# EAGLE design nrfsensornode (EAGLE 6.5.0)
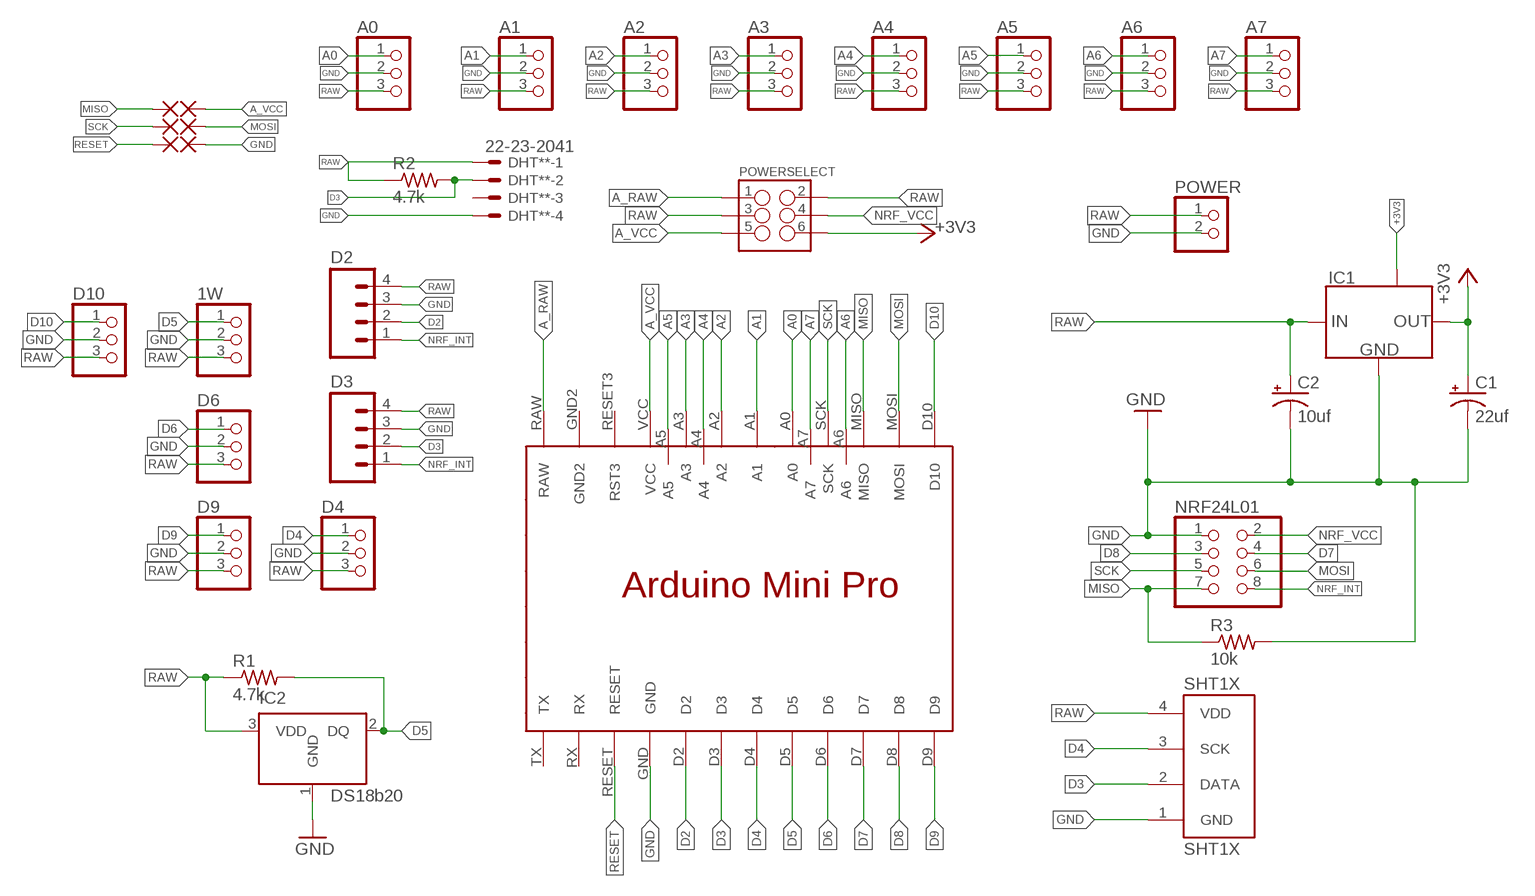
[diagram p0: schematic, sheet 1]

## Parts
1W  PINHD-1X3  [1X03]
5V  WIREPADSMD1,27-254  [SMD1,27-2,54]
A0  PINHD-1X3  [1X03]
A1  PINHD-1X3  [1X03]
A2  PINHD-1X3  [1X03]
A3  PINHD-1X3  [1X03]
A4  PINHD-1X3  [1X03]
A5  PINHD-1X3  [1X03]
A6  PINHD-1X3  [1X03]
A7  PINHD-1X3  [1X03]
C1  22uf  CPOL-USE2-4  [E2-4]
C2  10uf  CPOL-USE2-4  [E2-4]
D2  M04LOCK  [1X04_LOCK]
D3  M04LOCK  [1X04_LOCK]
D4  PINHD-1X3  [1X03]
D6  PINHD-1X3  [1X03]
D9  PINHD-1X3  [1X03]
D10  PINHD-1X3  [1X03]
DHT**  22-23-2041  [22-23-2041]
GND  WIREPADSMD1,27-254  [SMD1,27-2,54]
IC1  LM1117MPX-3.3  [SOT-223]
IC2  DS18b20  DS1820  [TO-92]
MISO  WIREPADSMD1,27-254  [SMD1,27-2,54]
MOSI  WIREPADSMD1,27-254  [SMD1,27-2,54]
NRF24L01  PINHD-2X4  [2X04]
POWER  PINHD-1X2  [1X02]
POWERSELECT  M03X2POGO_PINS  [2X3_POGO]
R1  4.7k  R-US_M1206  [M1206]
R2  4.7k  R-US_M1206  [M1206]
R3  10k  R-US_M1206  [M1206]
RST  WIREPADSMD1,27-254  [SMD1,27-2,54]
SCK  WIREPADSMD1,27-254  [SMD1,27-2,54]
SHT1X  SHT1X  [SHT1X]
U$1  ARDMINIPRO  [ARDMINIPRO]

## Nets
+3V3: C1.+ IC1.2(OUT) IC1.4(NC) POWERSELECT.P$6
A0: A0.1 U$1.A0
A1: A1.1 U$1.A1
A2: A2.1 U$1.A2
A3: A3.1 U$1.A3
A4: A4.1 U$1.A4
A5: A5.1 U$1.A5
A6: A6.1 U$1.A6
A7: A7.1 U$1.A7
A_RAW: POWERSELECT.P$1 U$1.RAW
A_VCC: 5V.1(P) POWERSELECT.P$5 U$1.VCC
D2: D2.2 U$1.D2
D3: D3.2 DHT**.2 R2.2 SHT1X.2(DATA) U$1.D3
D4: D4.1 SHT1X.3(SCK) U$1.D4
D5: 1W.1 IC2.2(DQ) R1.2 U$1.D5
D6: D6.1 U$1.D6
D7: NRF24L01.4 U$1.D7
D8: NRF24L01.3 U$1.D8
D9: D9.1 U$1.D9
D10: D10.1 U$1.D10
GND: 1W.2 A0.2 A1.2 A2.2 A3.2 A4.2 A5.2 A6.2 A7.2 C1.- C2.- D2.3 D3.3 D4.2 D6.2 D9.2 D10.2 DHT**.4 GND.1(P) IC1.1(GND) IC2.1(GND) NRF24L01.1 POWER.2 R3.2 SHT1X.1(GND) U$1.GND
MISO: MISO.1(P) NRF24L01.7 R3.1 U$1.MISO
MOSI: MOSI.1(P) NRF24L01.6 U$1.MOSI
NRF_INT: D2.1 D3.1 NRF24L01.8
NRF_VCC: NRF24L01.2 POWERSELECT.P$4
RAW: 1W.3 A0.3 A1.3 A2.3 A3.3 A4.3 A5.3 A6.3 A7.3 C2.+ D2.4 D3.4 D4.3 D6.3 D9.3 D10.3 DHT**.1 IC1.3(IN) IC2.3(VDD) POWER.1 POWERSELECT.P$2 POWERSELECT.P$3 R1.1 R2.1 SHT1X.4(VDD)
RESET: RST.1(P) U$1.RESET
SCK: NRF24L01.5 SCK.1(P) U$1.SCK
Unconnected: DHT**.3 U$1.GND2 U$1.RESET3(RST3) U$1.RX U$1.TX

## Library data of the parts
1W A0 A1-A7 D4 D6 D9 D10 = adafruit:PINHD-1X3: PIN HEADER
5V GND MISO MOSI RST SCK = wirepad:WIREPAD: Wire PAD connect wire on PCB
C1 C2 = adafruit:CPOL-US: POLARIZED CAPACITOR, American symbol
D2 D3 = SparkFun-Connectors:M04: Header 4 Standard 4-pin 0.1" header. Use with straight break away headers (SKU : PRT-00116), right angle break away headers (PRT-00553), swiss pins (PRT-00743), machine pins (PRT-00117), and female headers (PRT-00115). Molex polarized connector foot print use with SKU : PRT-08231 with associated crimp pins and housings. 1MM SMD Version SKU: PRT-10208
DHT** = con-molex:22-23-2041: .100" (2.54mm) Center Header - 4 Pin; MF: MOLEX; MPN: 22-23-2041; OC_FARNELL: 1462920; OC_NEWARK: 38C0355
IC1 = v-reg-lm1117:LM1117?*
IC2 = DS1820:DS1820: DS1820 - 1-Wire Digital Thermometer
NRF24L01 = pinhead:PINHD-2X4: PIN HEADER
POWER = pinhead:PINHD-1X2: PIN HEADER
POWERSELECT = SparkFun-Connectors:M03X2: 2x3 .1" header. Shrouded, with keying- CONN-10681 SMT- CONN-11415 Pogo pins- HW-11044; PROD_ID: HW-11044
R1-R3 = adafruit:R-US_: RESISTOR, American symbol
SHT1X = sht10_11_15:SHT1X
U$1 = zarya:ARDMINIPRO

## Board
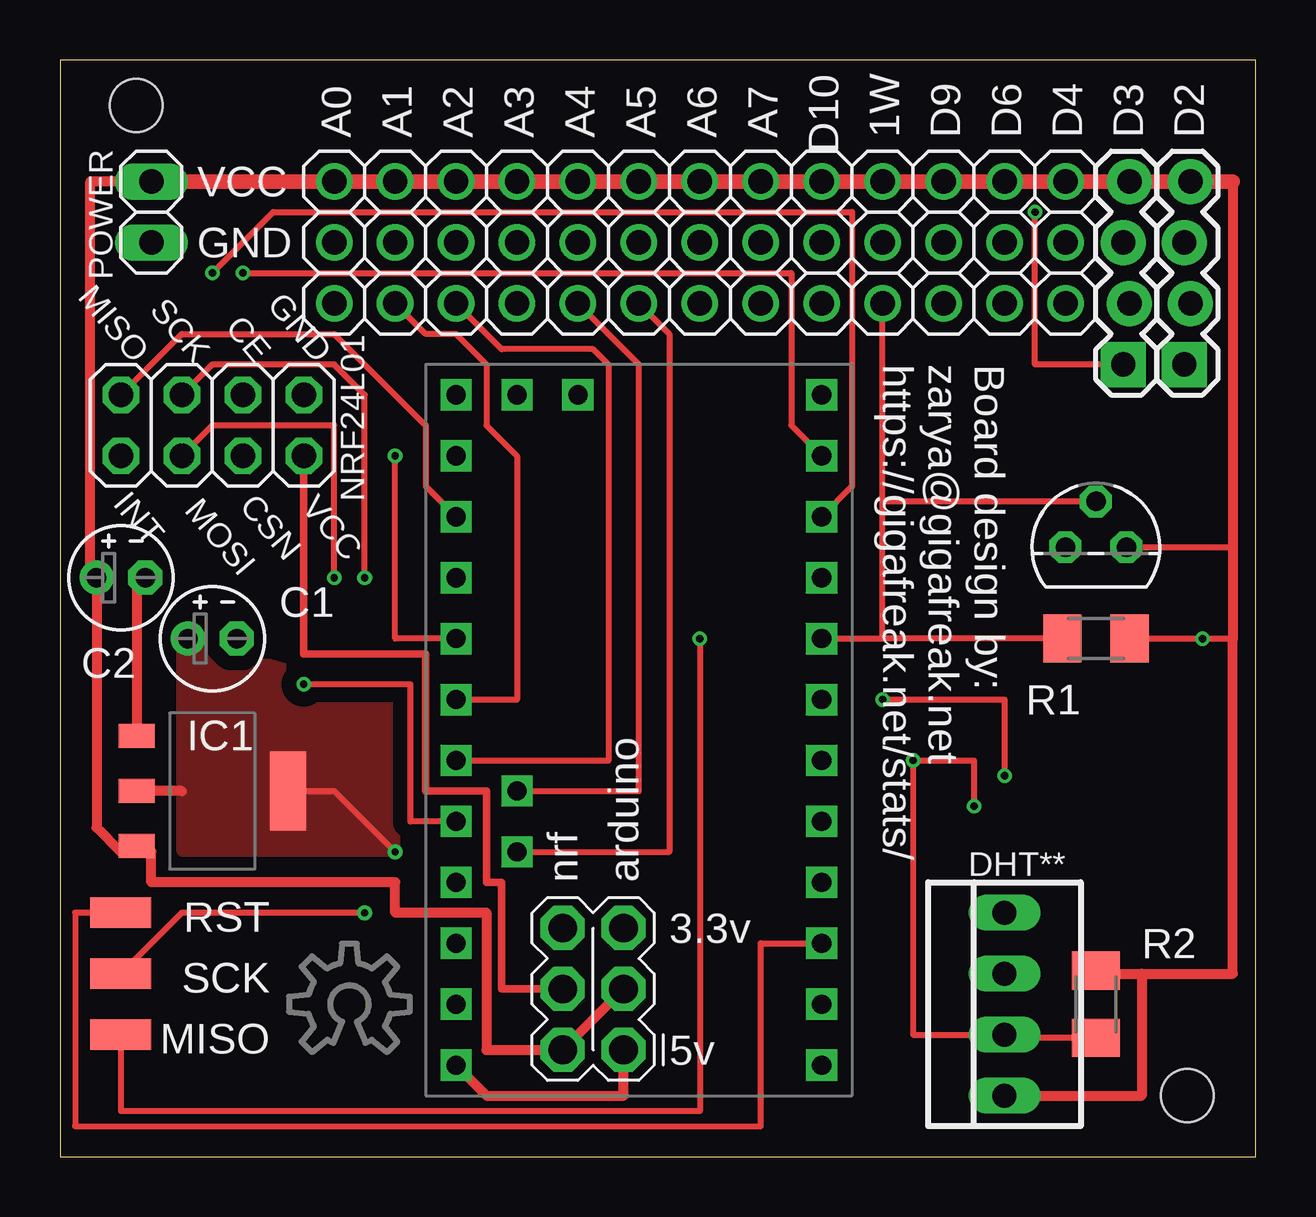
[diagram p1: board, top side]
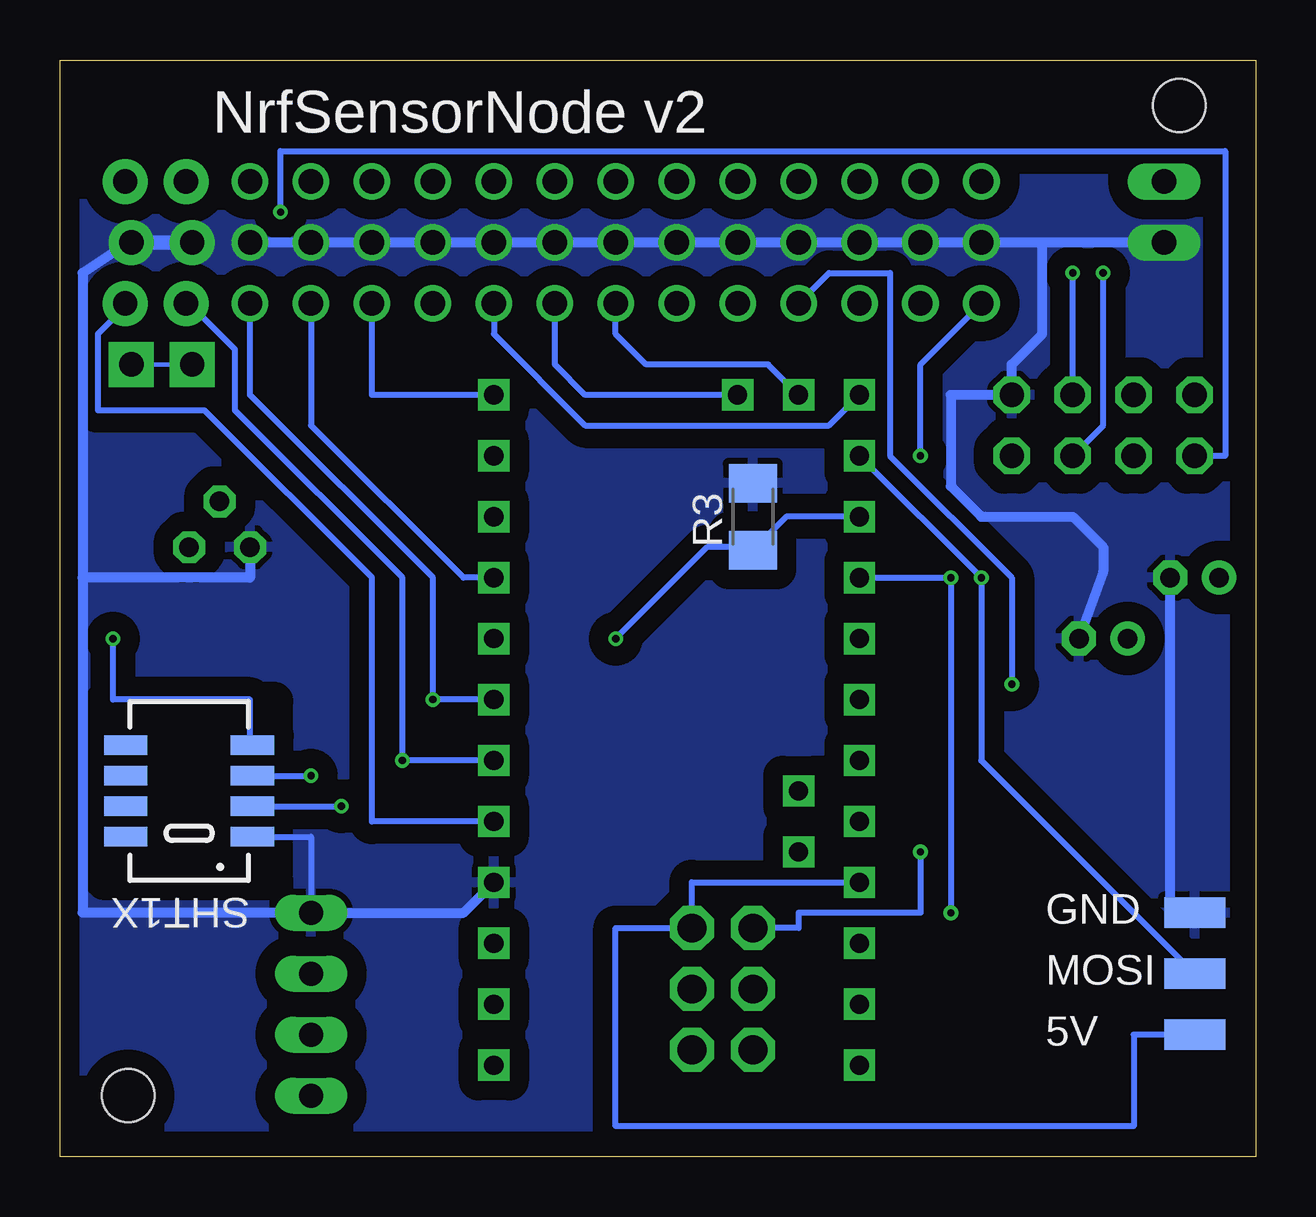
[diagram p2: board, bottom side, seen from below]

Size 49.84 x 45.71 mm. Coordinates in mm from the lower left corner, seen from the top.
Outline: 0,0 49.84,0 49.84,45.71 0,45.71 0,0
Copper layers (1*16): Top 0.035mm / dielectric 1.5mm / Bottom 0.035mm
Design rules "Smart-Prototyping": minimum track width 7mil, minimum drill 12mil, track to track 7mil, track to pad 7mil, pad to pad 7mil, via to via 7mil, smd to smd 0mil, copper to edge 20mil, drill to drill 10mil, minimum pad ring 10mil, minimum via ring 6mil, stop-mask expansion 2mil, vias tented up to drill 25mil, thermal gap 10mil
Holes 2.2 mm at 3.17,43.81 46.99,2.54

### Footprints (pad centres in the part's own frame; a part is rotated, then mirrored left to right if it is on the bottom)
1X03 = drill 1.016: 1 -2.54,0; 2 0,0; 3 2.54,0
SMD1,27-2,54 = smd 1.27 x 2.54: 1 0,0
E2-4 = drill 0.813 pad 1.422: + -1.016,0 | drill 0.813 pad 1.422 octagon: - 1.016,0
1X04_LOCK = drill 1.016 pad 1.88 square: 1 0,0.127 | drill 1.016 pad 1.88: 2 2.54,-0.127; 3 5.08,0.127; 4 7.62,-0.127
22-23-2041 = drill 1 long: 1 -3.81,0; 2 -1.27,0; 3 1.27,0; 4 3.81,0
SOT-223 = smd 1 x 1.5: 1 -2.3,-3.15; 2 0,-3.15; 3 2.3,-3.15 | smd 3.3 x 1.5: 4 0,3.15
TO-92 = drill 0.813 pad 1.27 octagon: 1 -1.27,0; 2 0,1.905; 3 1.27,0
2X04 = drill 1.016 octagon: 1 -3.81,-1.27; 2 -3.81,1.27; 3 -1.27,-1.27; 4 -1.27,1.27; 5 1.27,-1.27; 6 1.27,1.27; 7 3.81,-1.27; 8 3.81,1.27
1X02 = drill 1.016 long: 1 -1.27,0; 2 1.27,0
2X3_POGO = drill 1.2 pad 1.829 octagon: P$1 0,0; P$2 0,2.54; P$3 2.54,0; P$4 2.54,2.54; P$5 5.08,0; P$6 5.08,2.54
M1206 = smd 1.6 x 2: 1 -1.4,0; 2 1.4,0
SHT1X = smd 1.803 x 0.8: 1 -2.642,1.905; 2 -2.642,0.635; 3 -2.642,-0.635; 4 -2.642,-1.905; 5 2.642,-1.905; 6 2.642,-0.635; 7 2.642,0.635; 8 2.642,1.905
ARDMINIPRO = drill 0.8 square: A0 7.62,-3.81; A1 7.62,-1.27; A2 7.62,1.27; A3 7.62,3.81; A4 5.08,2.54; A5 5.08,5.08; A6 5.08,-13.97; A7 2.54,-13.97; D2 -7.62,3.81; D3 -7.62,1.27; D4 -7.62,-1.27; D5 -7.62,-3.81; D6 -7.62,-6.35; D7 -7.62,-8.89; D8 -7.62,-11.43; D9 -7.62,-13.97; D10 7.62,-13.97; GND -7.62,6.35; GND2 7.62,11.43; MISO 7.62,-8.89; MOSI 7.62,-11.43; RAW 7.62,13.97; RESET -7.62,8.89; RESET3 7.62,8.89; RX -7.62,11.43; SCK 7.62,-6.35; TX -7.62,13.97; VCC 7.62,6.35

### Placement (x,y rotation side)
1W  34.29,38.1 90 top
5V  2.54,5.08 270 bottom
A0  11.43,38.1 90 top
A1  13.97,38.1 90 top
A2  16.51,38.1 90 top
A3  19.05,38.1 90 top
A4  21.59,38.1 90 top
A5  24.13,38.1 90 top
A6  26.67,38.1 90 top
A7  29.21,38.1 90 top
C1  6.35,21.59 0 top
C2  2.54,24.13 0 top
D2  46.99,33.02 90 top
D3  44.45,33.02 90 top
D4  41.91,38.1 90 top
D6  39.37,38.1 90 top
D9  36.83,38.1 90 top
D10  31.75,38.1 90 top
DHT**  39.37,6.35 90 top
GND  2.54,10.16 270 bottom
IC1  6.35,15.24 270 top
IC2  43.18,25.4 0 top
MISO  2.54,5.08 90 top
MOSI  2.54,7.62 270 bottom
NRF24L01  6.35,30.48 180 top
POWER  3.81,39.37 270 top
POWERSELECT  23.5,4.45 90 top
R1  43.18,21.59 180 top
R2  43.18,6.35 270 top
R3  20.95,26.67 90 bottom
RST  2.54,10.16 90 top
SCK  2.54,7.62 90 top
SHT1X  44.45,15.24 180 bottom
U$1  24.13,17.78 180 top
U$2  [OSHWLOGO_TOL_0.2]  12.06,6.35 0 top

### Tracks (layer width: path | path; a pad name or v marks a point on that pad's centre or on a via)
+3V3  (via drill 0.3)
  Top 0.254: IC1.4 11.43,15.24 v13.97,12.7
  Top 0.406: 5.08,15.24 IC1.2
  Bottom 0.254: v13.97,12.7 13.97,10.16 19.05,10.16 19.05,9.53 POWERSELECT.P$6
  pour Top (isolate 0.61, no thermals): 5.08,12.7 5.08,21.59 13.97,19.05 13.97,12.7
A0  (via drill 0.3 pad 0.25)
  Top 0.254: U$1.A0 13.97,21.59 v13.97,29.21
  Bottom 0.254: v13.97,29.21 13.97,33.02 A0.1
A1
  Top 0.254: U$1.A1 19.05,19.05 19.05,29.21 17.78,30.48 17.78,33.02 16.51,34.29 15.24,34.29 A1.1
A2
  Top 0.254: U$1.A2 22.86,16.51 22.86,33.02 22.23,33.66 18.41,33.66 A2.1
A3  (via drill 0.3)
  Top 0.254: U$1.A3 14.61,13.97 14.61,19.68 v10.16,19.68
  Bottom 0.254: v10.16,19.68 10.16,24.13 15.24,29.21 15.24,36.83 17.78,36.83 A3.1
A4
  Top 0.254: U$1.A4 24.13,15.24 24.13,33.02 A4.1
A5
  Top 0.254: U$1.A5 25.4,12.7 25.4,34.29 A5.1
A6
  Bottom 0.254: U$1.A6 20.32,33.02 25.4,33.02 26.67,34.29 A6.1
A7
  Bottom 0.254: U$1.A7 27.94,31.75 29.21,33.02 A7.1
A_RAW
  Top 0.406: U$1.RAW 17.78,2.54 23.5,2.54 POWERSELECT.P$1
A_VCC
  Bottom 0.254: 5V.1 5.08,5.08 5.08,1.27 26.67,1.27 26.67,9.53 POWERSELECT.P$5 23.5,11.43 U$1.VCC
D2
  Bottom 0.178: 46.99,35.56 D2.2
  Bottom 0.254: U$1.D2 36.83,13.97 36.83,24.13 43.81,31.11 48.26,31.11 48.26,34.29 46.99,35.56
D3  (via drill 0.3)
  Top 0.254: R2.2 39.5,4.95 DHT**.2 35.56,5.08 v35.56,16.51 38.1,16.51 v38.1,14.61
  Bottom 0.178: 44.45,35.56 D3.2
  Bottom 0.254: U$1.D3 v35.56,16.51 35.56,24.13 42.55,31.11 42.55,33.66 44.45,35.56 | SHT1X.2 v38.1,14.61
D4  (via drill 0.3)
  Top 0.254: v34.29,19.05 39.37,19.05 v39.37,15.88
  Bottom 0.254: U$1.D4 v34.29,19.05 34.29,24.13 41.91,31.75 D4.1 | SHT1X.3 v39.37,15.88
D5
  Top 0.254: U$1.D5 34.29,21.59 | 34.29,21.59 34.29,27.3 | 34.29,27.3 1W.1 | R1.2 34.29,21.59 | IC2.2 34.29,27.3
D6
  Bottom 0.254: D6.1 39.37,30.48 33.02,24.13 U$1.D6
D7  (via drill 0.3)
  Top 0.254: U$1.D7 33.02,27.94 33.02,39.37 8.89,39.37 v6.35,36.83
  Bottom 0.254: v6.35,36.83 6.35,30.48 NRF24L01.4
D8  (via drill 0.3)
  Top 0.254: U$1.D8 30.48,30.48 30.48,36.83 v7.62,36.83
  Bottom 0.254: NRF24L01.3 v7.62,36.83
D9
  Bottom 0.254: U$1.D9 36.83,31.75 D9.1
D10
  Bottom 0.254: U$1.D10 17.78,30.48 27.94,30.48 31.75,34.29 D10.1
GND
  Top 0.406: 3.56,17.54 IC1.1 3.2,24.13 C2.-
  Bottom 0.254: GND.1 3.56,10.16 | SHT1X.1 39.37,13.34 DHT**.4
  Bottom 0.406: 3.56,10.16 C2.- | POWER.2 8.89,38.1 | 8.89,38.1 A0.2 A1.2 A2.2 A3.2 A4.2 A5.2 A6.2 A7.2 D10.2 1W.2 D9.2 D6.2 D4.2 | 48.9,24.13 48.9,36.83 46.99,38.1 | 48.9,24.13 48.9,10.16 DHT**.4 33.02,10.16 U$1.GND | IC2.1 41.91,24.13 48.9,24.13 | 8.89,38.1 8.89,34.29 10.16,33.02 NRF24L01.1 12.7,31.75 12.7,27.94 11.43,26.67 7.62,26.67 6.35,25.4 6.35,24.38 C1.-
  Bottom 0.61: 44.45,38.1 46.99,38.1
  pour Bottom (isolate 0.813): 1.27,44.45 48.9,44.45 48.9,1.27 1.27,1.27
  pour Bottom (isolate 0.813, no thermals): 0,45.72 48.9,45.72 48.9,34.29 0,34.29
MISO  (via drill 0.3)
  Top 0.254: U$1.MISO 15.24,27.94 15.24,30.48 11.43,34.29 5.08,34.29 NRF24L01.7 | v26.67,21.59 26.67,1.91 2.54,1.91 MISO.1
  Bottom 0.178: 21.59,25.4 R3.1
  Bottom 0.254: U$1.MISO 19.55,26.67 R3.1 | v26.67,21.59 22.86,25.4 21.59,25.4
MOSI  (via drill 0.3)
  Top 0.254: NRF24L01.6 6.35,30.48 11.43,30.48 v11.43,24.13
  Bottom 0.254: MOSI.1 11.43,16.51 v11.43,24.13 U$1.MOSI
NRF_INT  (via drill 0.3)
  Top 0.254: D3.1 40.64,33.02 v40.64,39.37
  Bottom 0.178: D3.1 D2.1 46.99,33.02
  Bottom 0.254: v40.64,39.37 40.64,41.91 1.27,41.91 1.27,29.21 NRF24L01.8
NRF_VCC
  Top 0.305: NRF24L01.2 10.16,20.95 15.24,20.95 15.24,15.24 17.78,15.24 17.78,11.43 18.41,11.43 18.41,6.99 POWERSELECT.P$4
RAW  (via drill 0.3)
  Top 0.178: 43.18,7.62 R2.1 | 46.99,40.64 D2.4
  Top 0.254: 3.44,12.7 IC1.3 | IC2.3 48.9,25.4 | R1.1 v47.62,21.59 48.9,21.59
  Top 0.406: POWER.1 1.27,40.64 1.27,24.13 C2.+ 1.52,13.72 2.54,12.7 2.96,12.7 IC1.3 3.2,12.7 3.81,12.7 3.81,11.43 13.97,11.43 13.97,10.16 17.78,10.16 17.78,4.45 POWERSELECT.P$2 POWERSELECT.P$3 | 48.9,40.64 48.9,25.4 48.9,21.59 48.9,7.62 45.09,7.62 | DHT**.1 45.09,2.54 45.09,7.62 | 43.18,7.62 45.09,7.62
  Top 0.61: POWER.1 A0.3 A1.3 A2.3 A3.3 A4.3 A5.3 A6.3 A7.3 D10.3 1W.3 D9.3 D6.3 D4.3 D3.4 46.99,40.64 48.9,40.64
  Bottom 0.254: SHT1X.4 41.91,17.14 41.91,19.05 47.62,19.05 v47.62,21.59
RESET
  Top 0.254: RST.1 0.64,10.16 0.64,1.27 29.21,1.27 29.21,8.89 U$1.RESET
SCK  (via drill 0.3)
  Top 0.254: SCK.1 5.08,10.16 v12.7,10.16 | NRF24L01.5 6.35,33.02 11.43,33.02 12.7,31.75 v12.7,24.13
  Bottom 0.254: v12.7,10.16 v12.7,24.13 U$1.SCK

### Text on the board
tNames: VCC | GND | MISO | SCK | CE | GND | Board design by: / zarya@gigafreak.net / https://gigafreak.net/stats/ | INT | MOSI | CSN | VCC
bNames: NrfSensorNode v2
_tNames: nrf | arduino | 3.3v | 5v